# Altium schematic sheet wireless.SchDoc: Bison-Board
size A4; DrawnBy: mzy2364; Revision: V1.4
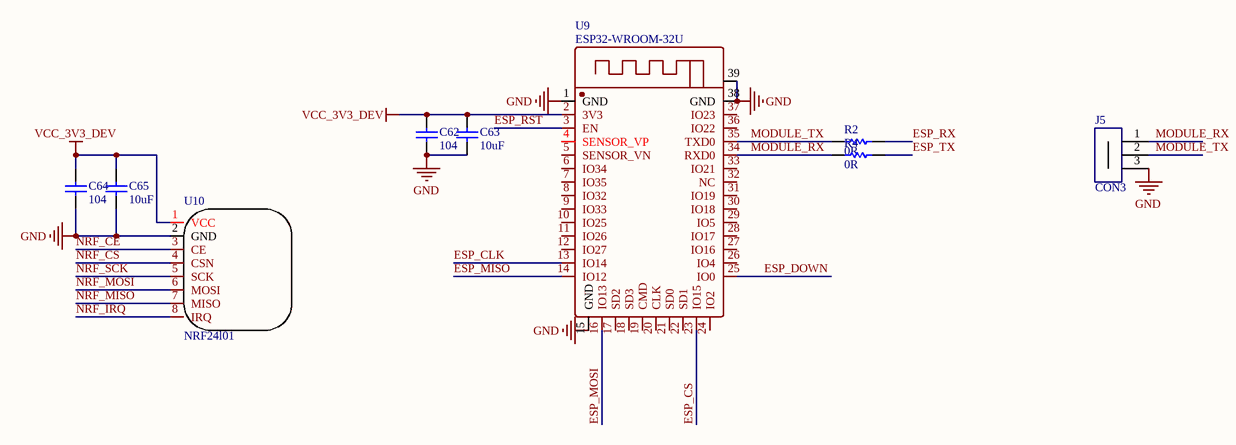
[diagram p0: wireless.SchDoc]

## Parts
C62  104  [C 0603]
C63  10uF  [C 0603]
C64  104  [C 0603]
C65  10uF  [C 0603]
J5  CON3  [SMD_3P-1.25]
R2  0R  [R 0603]
R4  0R  [R 0603]
U9  ESP32-WROOM-32U  [ESP32-WROOM-32U]
U10  NRF24l01  [NRF24l01]

## Nets
GND: C62.2 C63.2 C64.2 C65.2 J5.3 U9.1(GND) U9.15(GND) U9.38(GND) U9.39(GND) U10.2(GND)
VCC_3V3_DEV: C62.1 C63.1 C64.1 C65.1 U9.2(3V3) U10.1(VCC)
ESP_CLK: U9.13(IO14)
ESP_CS: U9.23(IO15)
ESP_DOWN: U9.25(IO0)
ESP_MISO: U9.14(IO12)
ESP_MOSI: U9.16(IO13)
ESP_RST: U9.3(EN)
ESP_RX: R2.2
ESP_TX: R4.2
MODULE_RX: J5.1 R4.1 U9.34(RXD0)
MODULE_TX: J5.2 R2.1 U9.35(TXD0)
NRF_CE: U10.3(CE)
NRF_CS: U10.4(CSN)
NRF_IRQ: U10.8(IRQ)
NRF_MISO: U10.7(MISO)
NRF_MOSI: U10.6(MOSI)
NRF_SCK: U10.5(SCK)

Not connected (* = marked no-connect by the designer): U9 4(SENSOR_VP) 5(SENSOR_VN) 6(IO34) 7(IO35) 8(IO32) 9(IO33) 10(IO25) 11(IO26) 12(IO27) 17(SD2) 18(SD3) 19(CMD) 20(CLK) 21(SD0) 22(SD1) 24(IO2) 26(IO4) 27(IO16) 28(IO17) 29(IO5) 30(IO18) 31(IO19) 32(NC) 33(IO21) 36(IO22) 37(IO23)

## Library data of the parts
C62-C65 = CAP
R2 R4 = RES